# Altium schematic sheet INTERPLACA.SchDoc
size A4
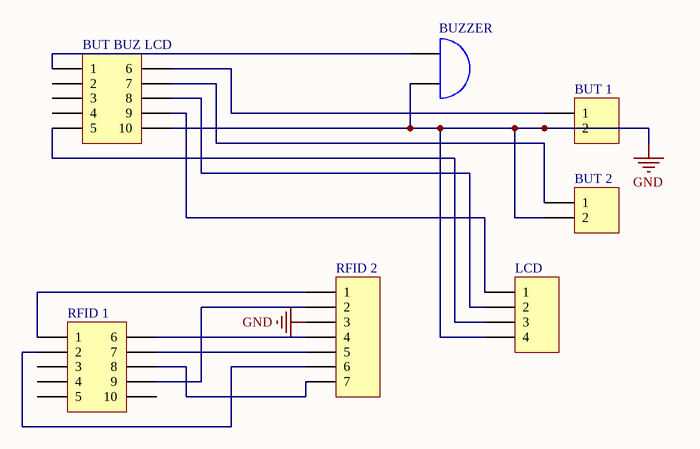
[diagram p0: INTERPLACA.SchDoc]

## Parts
BUT_1  Header 2  [BORNERA 2 pin]  (value not drawn)
BUT_2  Header 2  [BORNERA 2 pin]  (value not drawn)
BUT_BUZ_LCD  Header 5X2A  [HDR2X5_CEN]  (value not drawn)
BUZZER  Bell  [PIN2]  (value not drawn)
LCD  Header 4  [HDR1X4]  (value not drawn)
RFID_1  Header 5X2A  [HDR2X5_CEN]  (value not drawn)
RFID_2  Header 7  [HDR1X7]  (value not drawn)

## Nets
GND: BUT_1.2 BUT_2.2 BUT_BUZ_LCD.10 BUZZER.2(B) LCD.4 RFID_2.3
NetBUT_1_1: BUT_1.1 BUT_BUZ_LCD.6
NetBUT_2_1: BUT_2.1 BUT_BUZ_LCD.7
NetBUT_BUZ_LCD_1: BUT_BUZ_LCD.1 BUZZER.1(A)
NetBUT_BUZ_LCD_5: BUT_BUZ_LCD.5 LCD.3
NetBUT_BUZ_LCD_8: BUT_BUZ_LCD.8 LCD.2
NetBUT_BUZ_LCD_9: BUT_BUZ_LCD.9 LCD.1
NetRFID_1_1: RFID_1.1 RFID_2.1
NetRFID_1_2: RFID_1.2 RFID_2.6
NetRFID_1_6: RFID_1.6 RFID_2.4
NetRFID_1_7: RFID_1.7 RFID_2.5
NetRFID_1_8: RFID_1.8 RFID_2.7
NetRFID_1_9: RFID_1.9 RFID_2.2

Not connected (* = marked no-connect by the designer): BUT_BUZ_LCD 2 3 4; RFID_1 3 4 5 10

## Library data of the parts
BUT_1 BUT_2 = Header 2: Header, 2-Pin; LatestRevisionDate: 17-Jul-2002; LatestRevisionNote: Re-released for DXP Platform.; Publisher: Altium Limited
BUT_BUZ_LCD RFID_1 = Header 5X2A: Header, 5-Pin, Dual row; LatestRevisionDate: 17-Jul-2002; LatestRevisionNote: Re-released for DXP Platform.; Publisher: Altium Limited
BUZZER = Bell: Electrical Bell; Published: 24-Mar-1999; LatestRevisionDate: 17-Jul-2002; LatestRevisionNote: Re-released for DXP Platform.; PackageReference: PIN2; Publisher: Altium Limited
LCD = Header 4: Header, 4-Pin; LatestRevisionDate: 17-Jul-2002; LatestRevisionNote: Re-released for DXP Platform.; Publisher: Altium Limited
RFID_2 = Header 7: Header, 7-Pin; LatestRevisionDate: 17-Jul-2002; LatestRevisionNote: Re-released for DXP Platform.; Publisher: Altium Limited